# EAGLE design core (EAGLE 6.5.0)
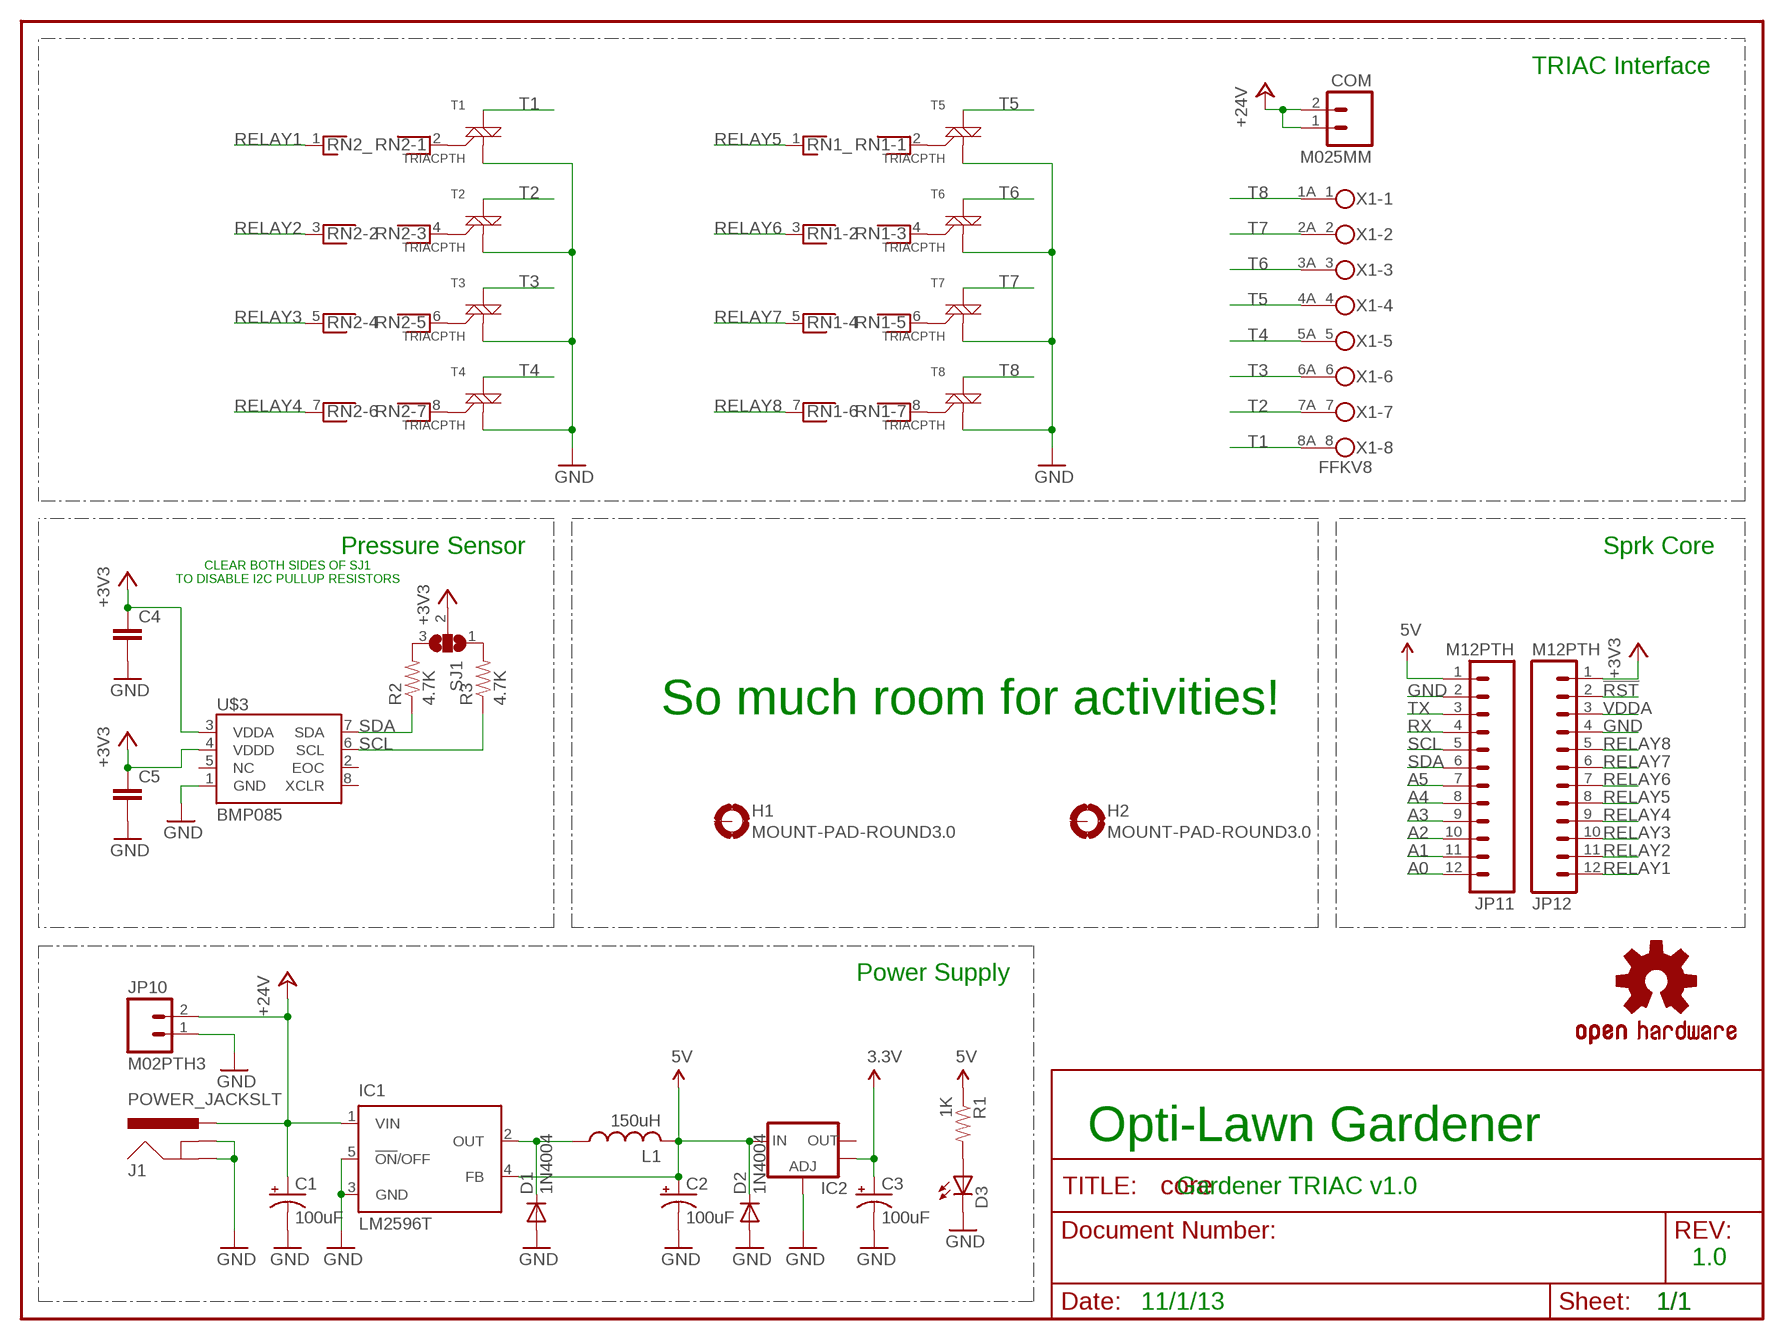
[diagram p0: schematic, sheet 1]

## Parts
C1  100uF  CAP_POLPTH1  [CPOL-RADIAL-100UF-25V]
C2  100uF  CAP_POLPTH1  [CPOL-RADIAL-100UF-25V]
C3  100uF  CAP_POLPTH1  [CPOL-RADIAL-100UF-25V]
C4  CAP0402-CAP  [0402-CAP]
C5  CAP0402-CAP  [0402-CAP]
COM  M025MM  [SCREWTERMINAL-5MM-2]
D1  1N4004  [DO41-10]
D2  1N4004  [DO41-10]
D3  LED3MM  [LED3MM]
H1  MOUNT-PAD-ROUND3.0  [3,0-PAD]
H2  MOUNT-PAD-ROUND3.0  [3,0-PAD]
IC1  LM2596T  [T05D]
IC2  V_REG_LM1117SOT223  [SOT223]
J1  POWER_JACKSLT  [POWER_JACK_SLOT]
JP10  M02PTH3  [1X02_LONGPADS]
JP11  M12PTH  [1X12-SMALL-PADS]
JP12  M12PTH  [1X12-SMALL-PADS]
L1  150uH  L  [6000]
LOGO2  OSHW-LOGOL  [OSHW-LOGO-L]
R1  1K  RESISTORAXIAL-0.3  [AXIAL-0.3]
R2  4.7K  RESISTORAXIAL-0.3  [AXIAL-0.3]
R3  4.7K  RESISTORAXIAL-0.3  [AXIAL-0.3]
RN1  RNX7  [RN-8]
RN2  RNX7  [RN-8]
SJ1  SJ2W  [SJ_2]
T1  TRIACPTH  [TO-92]
T2  TRIACPTH  [TO-92]
T3  TRIACPTH  [TO-92]
T4  TRIACPTH  [TO-92]
T5  TRIACPTH  [TO-92]
T6  TRIACPTH  [TO-92]
T7  TRIACPTH  [TO-92]
T8  TRIACPTH  [TO-92]
U$3  BMP085  [BMP085]
X1  FFKV8  [FFKV8]

## Nets
3.3V: C3.1(+) IC2.4(OUT)
5V: C2.1(+) D2.C IC1.4(FB) IC2.3(IN) JP11.1 L1.2 R1.P$1
!RST: JP12.2
+3V3: C4.1 C5.1 JP12.1 SJ1.2 U$3.3(VDDA) U$3.4(VDDD)
+24V: C1.1(+) COM.1 COM.2 IC1.1(VIN) J1.PWR JP10.2
A0: JP11.12
A1: JP11.11
A2: JP11.10
A3: JP11.9
A4: JP11.8
A5: JP11.7
GND [vcc]: C1.2(-) C2.2(-) C3.2(-) C4.2 C5.2 D1.A D2.A D3.K(C) IC1.3(GND) IC1.5(!ON!/OFF) IC2.1(ADJ) J1.GND@1(GNDBREAK) J1.GND@2(GND) JP10.1 JP11.2 JP12.4 T1.1(M1) T2.1(M1) T3.1(M1) T4.1(M1) T5.1(M1) T6.1(M1) T7.1(M1) T8.1(M1) U$3.1(GND)
N$1: RN1.4 T6.2(G)
N$2: RN1.2 T5.2(G)
N$3: RN2.2 T1.2(G)
N$4: RN2.4 T2.2(G)
N$5: RN2.6 T3.2(G)
N$6: RN2.8 T4.2(G)
N$7: RN1.6 T7.2(G)
N$8: R2.P$2 SJ1.3
N$9: R3.P$2 SJ1.1
N$10: D1.C IC1.2(OUT) L1.1
N$18: RN1.8 T8.2(G)
N$39: D3.A R1.P$2
RELAY1: JP12.12 RN2.1
RELAY2: JP12.11 RN2.3
RELAY3: JP12.10 RN2.5
RELAY4: JP12.9 RN2.7
RELAY5: JP12.8 RN1.1
RELAY6: JP12.7 RN1.3
RELAY7: JP12.6 RN1.5
RELAY8: JP12.5 RN1.7
RX: JP11.4
SCL: JP11.5 R3.P$1 U$3.6(SCL)
SDA: JP11.6 R2.P$1 U$3.7(SDA)
T1: T1.3(M2) X1.8A
T2: T2.3(M2) X1.7A
T3: T3.3(M2) X1.6A
T4: T4.3(M2) X1.5A
T5: T5.3(M2) X1.4A
T6: T6.3(M2) X1.3A
T7: T7.3(M2) X1.2A
T8: T8.3(M2) X1.1A
TX: JP11.3
VDDA: JP12.3
Unconnected: H1.B3,0(MOUNT) H2.B3,0(MOUNT) IC2.2(OUT) U$3.2(EOC) U$3.5(NC) U$3.8(XCLR) X1.1 X1.2 X1.3 X1.4 X1.5 X1.6 X1.7 X1.8

## Notes on the sheet
- TRIAC Interface
- Pressure Sensor | Sprk Core
- CLEAR BOTH SIDES OF SJ1
  TO DISABLE I2C PULLUP RESISTORS
- So much room for activities!
- Power Supply
- Opti-Lawn Gardener
- Gardener TRIAC v1.0
- 1.0
- 11/1/13 | 1/1

## Library data of the parts
C1-C3 = SparkFun-Passives:CAP_POL: Capacitor Polarized These are standard SMD and PTH capacitors. Normally 10uF, 47uF, and 100uF in electrolytic and tantalum varieties. Always verify the external diameter of the through hole cap, it varies with capacity, voltage, and manufacturer. The EIA devices should be standard.; MPN: 10NA100MEFC6.3X11; OC_NEWARK: 54T4154
C4 C5 = SparkFun-Passives:CAP: Capacitor Standard 0603 ceramic capacitor, and 0.1" leaded capacitor.; OC_NEWARK: unknown
COM = SparkFun-Connectors:M02: Standard 2-pin 0.1" header. Use with - straight break away headers ( PRT-00116) - right angle break away headers (PRT-00553) - swiss pins (PRT-00743) - machine pins (PRT-00117) - female headers (PRT-00115) Molex polarized connector foot print use with: PRT-08233 with associated crimp pins and housings. 2.54_SCREWTERM for use with PRT-10571. 3.5mm Screw Terminal footprints for PRT-08084 5mm Screw Terminal footprints for use with PRT-08433; MPN: 724; OC_NEWARK: 53W6206
D1 D2 = diode:1N4004: DIODE general purpose rectifier, 1 A; MF: FAIRCHILD SEMICONDUCTOR; MPN: 1N4004; OC_NEWARK: 18C8917
D3 = SparkFun-LED:LED: LEDs Standard schematic elements and footprints for 5mm, 3mm, 1206, and 0603 sized LEDs. 5mm - Spark Fun Electronics SKU : COM-00529 (and others); MPN: L-710A8CB/1GD; OC_NEWARK: 87W9956
H1 H2 = holes:MOUNT-PAD-ROUND: MOUNTING PAD, round; OC_NEWARK: unknown
IC1 = national-semiconductor:LM2596: SIMPLE SWITCHER® Power Converter 150 kHz 3A Step-Down Voltage Regulator Source: http://www.national.com/ds/LM/LM2596.pdf; MF: NATIONAL SEMICONDUCTOR; MPN: LM2596T-5.0/NOPB; OC_FARNELL: 9494162; OC_NEWARK: 41K3851
IC2 = SparkFun-PowerIC:V_REG_LM1117: Voltage Regulator LM1117 Standard adjustable voltage regulator but in SMD form. Spark Fun Electronics SKU : COM-00595; MPN: LM1117MPX-3.3/NOPB; OC_NEWARK: 12X9029
J1 = SparkFun-Connectors:POWER_JACK: Power Jack This is the standard 5.5mm barrel jack for power. The PTH is the most common, proven, reliable, footprint. The Slot footprint only works if the mill layer is transmitted to the PCB fab house so be warned. Spark Fun Electronics SKU : PRT-00119 SMT: CONN-08106 Mating wall wart : TOL-00298 (and others); OC_NEWARK: unknown
JP10 = SparkFun-Connectors:M02: Standard 2-pin 0.1" header. Use with - straight break away headers ( PRT-00116) - right angle break away headers (PRT-00553) - swiss pins (PRT-00743) - machine pins (PRT-00117) - female headers (PRT-00115) Molex polarized connector foot print use with: PRT-08233 with associated crimp pins and housings. 2.54_SCREWTERM for use with PRT-10571. 3.5mm Screw Terminal footprints for PRT-08084 5mm Screw Terminal footprints for use with PRT-08433; OC_NEWARK: unknown
JP11 JP12 = Spark:M12: Header 12 Standard 12-pin 0.1" header. Use with straight break away headers (SKU : PRT-00116), right angle break away headers (PRT-00553), swiss pins (PRT-00743), machine pins (PRT-00117), and female headers (PRT-00115).; OC_NEWARK: unknown
L1 = adafruit:L; MPN: RLB9012-151KL; OC_NEWARK: 32M9853
LOGO2 = SparkFun-Aesthetics:OSHW-LOGO: Open Source Hardware Logo This logo indicates the piece of hardware it is found on incorporates a OSHW license and/or adheres to the definition of open source hardware found here: http://freedomdefined.org/OSHW; OC_NEWARK: unknown
R1 = SparkFun-Resistors:RESISTOR: Resistor Basic schematic elements and footprints for 0603, 1206, and PTH resistors.; MF: FARNELL; MPN: MCF 1W 1K; OC_NEWARK: 38K0400
R2 R3 = SparkFun-Resistors:RESISTOR: Resistor Basic schematic elements and footprints for 0603, 1206, and PTH resistors.; MF: FARNELL; MPN: MF25 4K7; OC_NEWARK: 38K5355
RN1 RN2 = resistor-net:RNX7: RESISTOR NETWORK; MPN: CSC09A01330RGEK; OC_FARNELL: unknown; OC_NEWARK: 71M1507
SJ1 = jumper:SJ2W: SMD solder JUMPER; OC_NEWARK: unknown
T1-T8 = SparkFun-DiscreteSemi:TRIAC: Low-power generic TRIAC packages; MF: ON SEMICONDUCTOR; MPN: MAC97A6G; OC_NEWARK: 26K3660
U$3 = SparkFun-Sensors:BMP085: BMP085 Pressure Sensor Great little MEMS pressure sensor. SKU: COM-09603; OC_NEWARK: unknown
X1 = con-phoenix-508:FFKV8: PHOENIX; OC_FARNELL: unknown; OC_NEWARK: unknown

## Net classes
2 RF: width 0.635 mm, clearance 0.762 mm

## Board
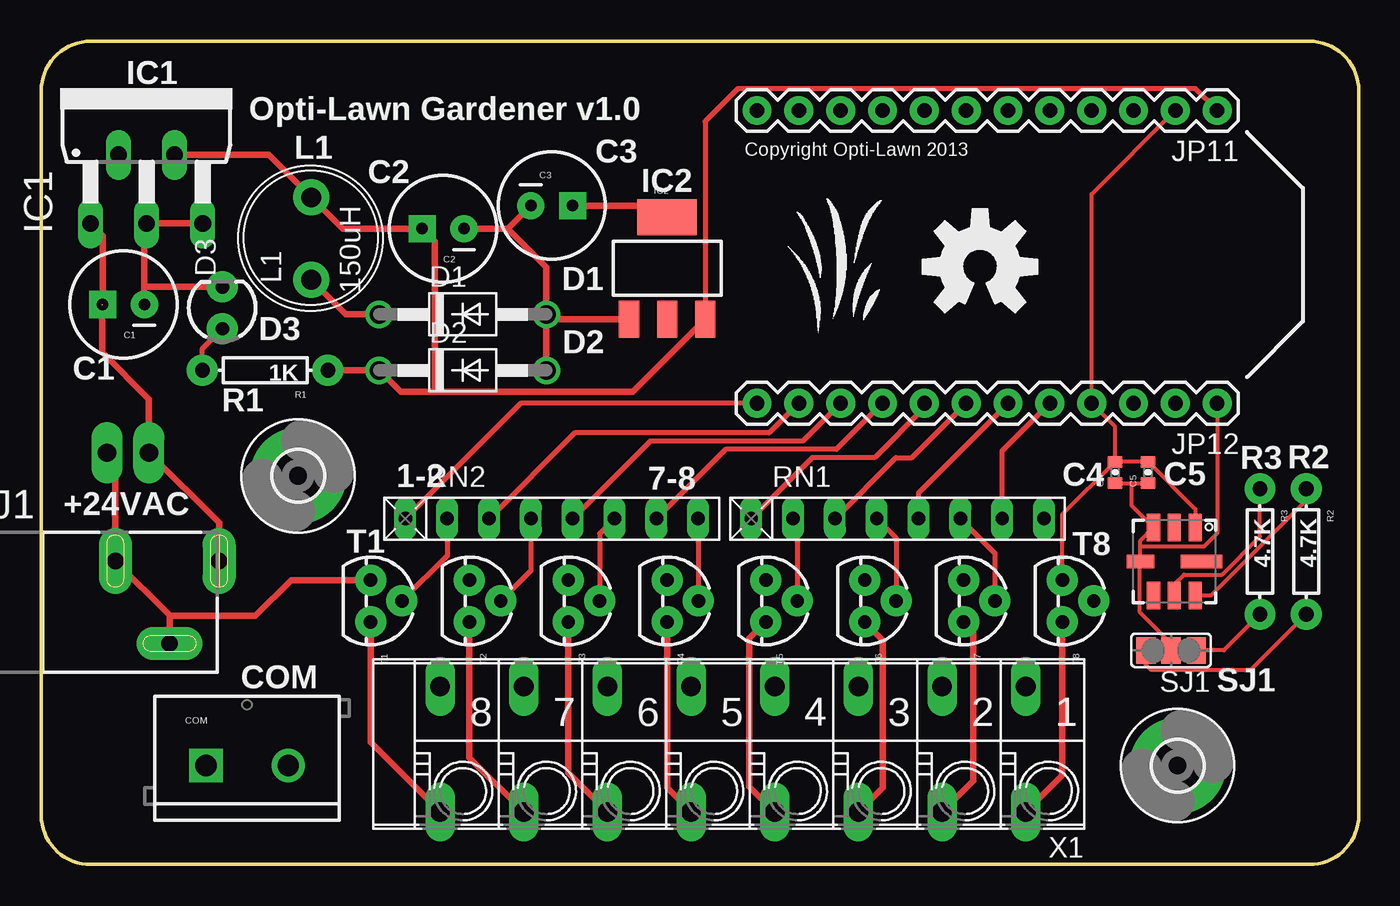
[diagram p1: board, top side]
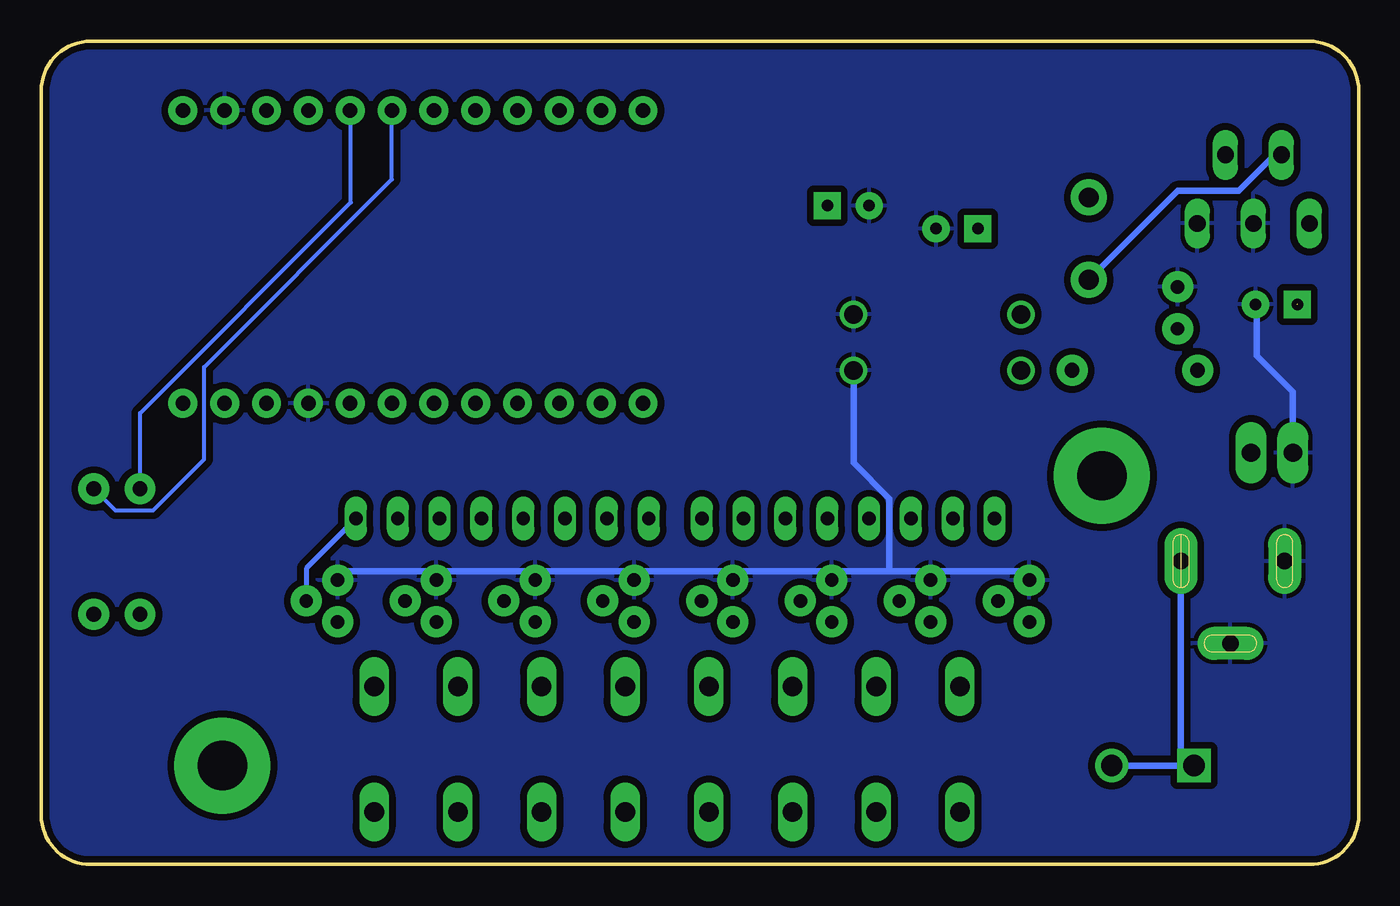
[diagram p2: board, bottom side, seen from below]

Size 80 x 49.99 mm. Coordinates in mm from the lower left corner, seen from the top.
Outline: 0,3 0,46.99 arc-90 3,49.99 77,49.99 arc-90 80,46.99 80,3 arc-90 77,0 3,0 arc-90 0,3
Copper layers (1*16): Top 0.035mm / dielectric 1.5mm / Bottom 0.035mm
Design rules "ITEADstudio_DRC": minimum track width 6mil, minimum drill 12mil, track to track 6mil, track to pad 6mil, pad to pad 6mil, via to via 6mil, smd to smd 0mil, copper to edge 10mil, drill to drill 10mil, minimum pad ring 10mil, minimum via ring 6mil, stop-mask expansion 2mil, vias tented up to drill 100mil, thermal gap 10mil

### Footprints (pad centres in the part's own frame; a part is rotated, then mirrored left to right if it is on the bottom)
CPOL-RADIAL-100UF-25V = drill 0.7 pad 1.651 square: 1 1.27,0 | drill 0.7 pad 1.651: 2 -1.27,0
0402-CAP = smd 0.7 x 0.9: 1 -0.65,0; 2 0.65,0
SCREWTERMINAL-5MM-2 = drill 1.3 pad 2.032 square: 1 0,0 | drill 1.3 pad 2.032: 2 5,0
DO41-10 = drill 1.118: A 5.08,0; C -5.08,0
LED3MM = drill 0.813 pad 1.88: A -1.27,0; K 1.27,0
3,0-PAD = drill 3 pad 5.842: B3,0 0,0
T05D = drill 1.016 long: 1 -3.404,-5.08; 2 -1.702,-0.914; 3 0,-5.08; 4 1.702,-0.914; 5 3.404,-5.08
SOT223 = smd 1.219 x 2.235: 1 -2.311,-3.099; 2 0,-3.099; 3 2.311,-3.099 | smd 3.6 x 2.2: 4 0,3.099
POWER_JACK_SLOT = drill 1 pad 2 long: GND@1 2.58,7.5; GND@2 7.58,10.8; PWR 2.58,13.8
1X02_LONGPADS = drill 1.118 pad 1.88 long: 1 0,0; 2 2.54,0
1X12-SMALL-PADS = drill 0.889 pad 1.753: 1 0,0; 2 2.54,0; 3 5.08,0; 4 7.62,0; 5 10.16,0; 6 12.7,0; 7 15.24,0; 8 17.78,0; 9 20.32,0; 10 22.86,0; 11 25.4,0; 12 27.94,0
6000 = drill 1.2 pad 2.184: 1 -2.5,0; 2 2.5,0
AXIAL-0.3 = drill 0.9 pad 1.88: P$1 -3.81,0; P$2 3.81,0
RN-8 = drill 0.813 long: 1 -8.89,0; 2 -6.35,0; 3 -3.81,0; 4 -1.27,0; 5 1.27,0; 6 3.81,0; 7 6.35,0; 8 8.89,0
SJ_2 = smd 1.168 x 1.6: 1 -1.524,0; 2 0,0; 3 1.524,0
TO-92 = drill 0.813 pad 1.88: 1 -1.27,0; 2 0,1.905; 3 1.27,0
BMP085 = smd 1.67 x 0.8: 1 -2.065,1.27; 2 -2.065,0; 3 -2.065,-1.27; 5 2.065,-1.27; 6 2.065,0; 7 2.065,1.27 | smd 0.8 x 1.67: 4 0,-2.065 | smd 0.8 x 2.5: 8 0,1.65
FFKV8 = drill 1.194 long: 1 -17.78,-3.81; 1A -17.78,3.81; 2 -12.7,-3.81; 2A -12.7,3.81; 3 -7.62,-3.81; 3A -7.62,3.81; 4 -2.54,-3.81; 4A -2.54,3.81; 5 2.54,-3.81; 5A 2.54,3.81; 6 7.62,-3.81; 6A 7.62,3.81; 7 12.7,-3.81; 7A 12.7,3.81; 8 17.78,-3.81; 8A 17.78,3.81

### Placement (x,y rotation side)
C1  5,34 180 top
C2  24.4,38.6 180 top
C3  31,40 0 top
C4  65.2,23.8 90 top
C5  67.2,23.8 90 top
COM  10,6 0 top
D1  25.6,33.4 0 top
D2  25.6,30 0 top
D3  11,33.8 90 top
H1  15.6,23.6 0 top
H2  69,6 0 top
IC1  6.4,44 0 top
IC2  38,36.2 0 top
J1  -3,21 270 top
JP10  4,25 0 top
JP11  71.4,45.78 180 top
JP12  71.4,28 180 top
L1  16.4,38 90 top
LOGO2  57,36.3 0 top
R1  13.6,30 180 top
R2  76.8,19 270 top
R3  74,19 270 top
RN1  52,21 0 top
RN2  31,21 0 top
SJ1  68.6,13 180 top
T1  20,16 270 top
T2  26,16 270 top
T3  32,16 270 top
T4  38,16 270 top
T5  44,16 270 top
T6  50,16 270 top
T7  56,16 270 top
T8  62,16 270 top
U$3  68.8,18.4 270 top
X1  42,7 180 top

### Tracks (layer width: path | path; a pad name or v marks a point on that pad's centre or on a via)
3.3V
  Top 0.406: C3.1 37.3,40 IC2.4
5V
  Top 0.305: JP11.1 70.08,47.1 42.3,47.1 40.31,45.11 IC2.3
  Top 0.406: IC1.4 13.81,43.09 L1.2 18.3,38.6 C2.1 23.9,37.83 23.9,28.7 | IC2.3 35.91,28.7 23.9,28.7 | 23.9,28.7 21.82,28.7 D2.C R1.P$1
+3V3
  Top 0.254: SJ1.2 68.6,13.4 66.7,15.3 66.7,18.36 U$3.4 66.73,19.3 | 66.73,19.3 66.73,19.67 U$3.3 66.2,21.8 66.2,23.15 | JP12.1 71.4,20.1 70.6,19.3 66.73,19.3 | C4.1 66.2,23.15 | 66.2,23.15 C5.1
+24V  (1 unrouted)
  Top 0.406: J1.PWR 10.8,20.74 JP10.2 6.54,28.26 3.7,31.1 3.7,33.97 | C1.1 3.73,38.19 IC1.1
  Bottom 0.406: COM.2 COM.1 10.8,6.8 J1.PWR
GND
  Top 0.254: C4.2 C5.2 70.07,21.58 U$3.1 | C4.2 65.2,26.58 JP12.4 63.78,40.7 JP11.2 | T8.1 62,21.25 C4.2
  Top 0.406: J1.GND@2 7.8,15.12 | 7.8,15.12 J1.GND@1 4.5,24.5 JP10.1 | T1.1 15.17,17.27 13,15.1 7.82,15.1 7.8,15.12 | C1.2 6.27,35 | 6.27,35 6.27,38.79 IC1.3 IC1.5 | D3.K 6.34,35.07 6.27,35 | C2.2 28.33,38.6 | 28.33,38.6 C3.2 | D1.A 30.68,36.25 28.33,38.6 | D1.A D2.A | IC2.1 30.98,33.1 D1.A
  Bottom 0.406: JP10.1 4,28.7 6.2,30.9 6.2,33.93 C1.2 | T1.1 20.53,17.8 25.47,17.8 T2.1 26.53,17.8 28.5,17.8 | 28.5,17.8 31.47,17.8 T3.1 32.53,17.8 37.47,17.8 T4.1 38.53,17.8 43.47,17.8 T5.1 44.53,17.8 49.47,17.8 T6.1 50.53,17.8 55.47,17.8 T7.1 56.53,17.8 61.47,17.8 T8.1 | D2.A 30.68,24.38 28.5,22.2 28.5,17.8
  pour Bottom (isolate 0.406): 0,0 0,49.99 79.98,49.99 80,0
N$1
  Top 0.305: RN1.4 51.91,19.82 T6.2
N$2
  Top 0.305: RN1.2 45.91,20.75 T5.2
N$3
  Top 0.305: RN2.2 24.65,18.75 T1.2
N$4
  Top 0.305: RN2.4 29.73,17.82 T2.2
N$5
  Top 0.305: RN2.6 33.91,20.09 T3.2
N$6
  Top 0.305: RN2.8 39.91,20.98 T4.2
N$7
  Top 0.305: RN1.6 57.91,18.91 T7.2
N$8
  Top 0.254: R2.P$2 73.41,11.8 67.4,11.8 67.08,12.12 SJ1.3
N$9
  Top 0.254: R3.P$2 71.81,13 SJ1.1
N$10
  Top 0.406: D1.C 18.5,33.4 L1.1
  Bottom 0.406: IC1.2 5.11,43.09 7.3,40.9 11,40.9 L1.1
N$18
  Bottom 0.305: RN1.8 63.91,17.98 T8.2
N$39
  Top 0.305: R1.P$2 9.79,31.32 D3.A
RELAY1
  Top 0.305: JP12.12 29.11,28 RN2.1
RELAY2
  Top 0.305: JP12.11 44.2,26.2 32.39,26.2 RN2.3
RELAY3
  Top 0.305: JP12.10 46.24,25.7 36.97,25.7 RN2.5
RELAY4
  Top 0.305: JP12.9 48.28,25.2 41.55,25.2 RN2.7
RELAY5
  Top 0.305: JP12.8 53.62,27.72 50.6,24.7 46.81,24.7 RN1.1
RELAY6
  Top 0.305: RN1.3 51.9,24.7 52.86,24.7 JP12.7
RELAY7
  Top 0.305: RN1.5 53.27,22.57 JP12.6
RELAY8
  Top 0.305: RN1.7 58.35,25.11 JP12.5
SCL
  Top 0.254: U$3.6 68.8,17 69.4,17.6 71.7,17.6 74,19.9 R3.P$1
  Bottom 0.254: R3.P$1 74,27.4 61.2,40.2 61.2,45.74 JP11.5
SDA
  Top 0.254: U$3.7 71.03,16.34 76.8,22.1 R2.P$1
  Bottom 0.254: R2.P$1 75.49,21.5 73.2,21.5 70.1,24.6 70.1,30.2 58.7,41.6 JP11.6
T1
  Top 0.406: X1.8A 20,7.41 T1.3
T2
  Top 0.406: X1.7A 26,6.49 T2.3
T3
  Top 0.406: X1.6A 32,5.57 T3.3
T4
  Top 0.406: X1.5A 38,4.65 T4.3
T5
  Top 0.406: X1.4A 43,4.73 43,13.73 T5.3
T6
  Top 0.406: X1.3A 51.1,4.67 51.1,13.63 T6.3
T7
  Top 0.406: X1.2A 56.6,5.09 56.6,14.13 T7.3
T8
  Top 0.406: X1.1A 62,5.41 T8.3

### Text on the board
tPlace: IC1 | Opti-Lawn Gardener v1.0 | L1 | C3 | Copyright Opti-Lawn 2013 | C2 | IC2 | D1 | D3 | D2 | C1 | R1 | R3 | R2 | 1-2 | 7-8 | C4 | C5 | +24VAC | T1 | T8 | COM | SJ1